# EAGLE design untitled (EAGLE 9.6.1)
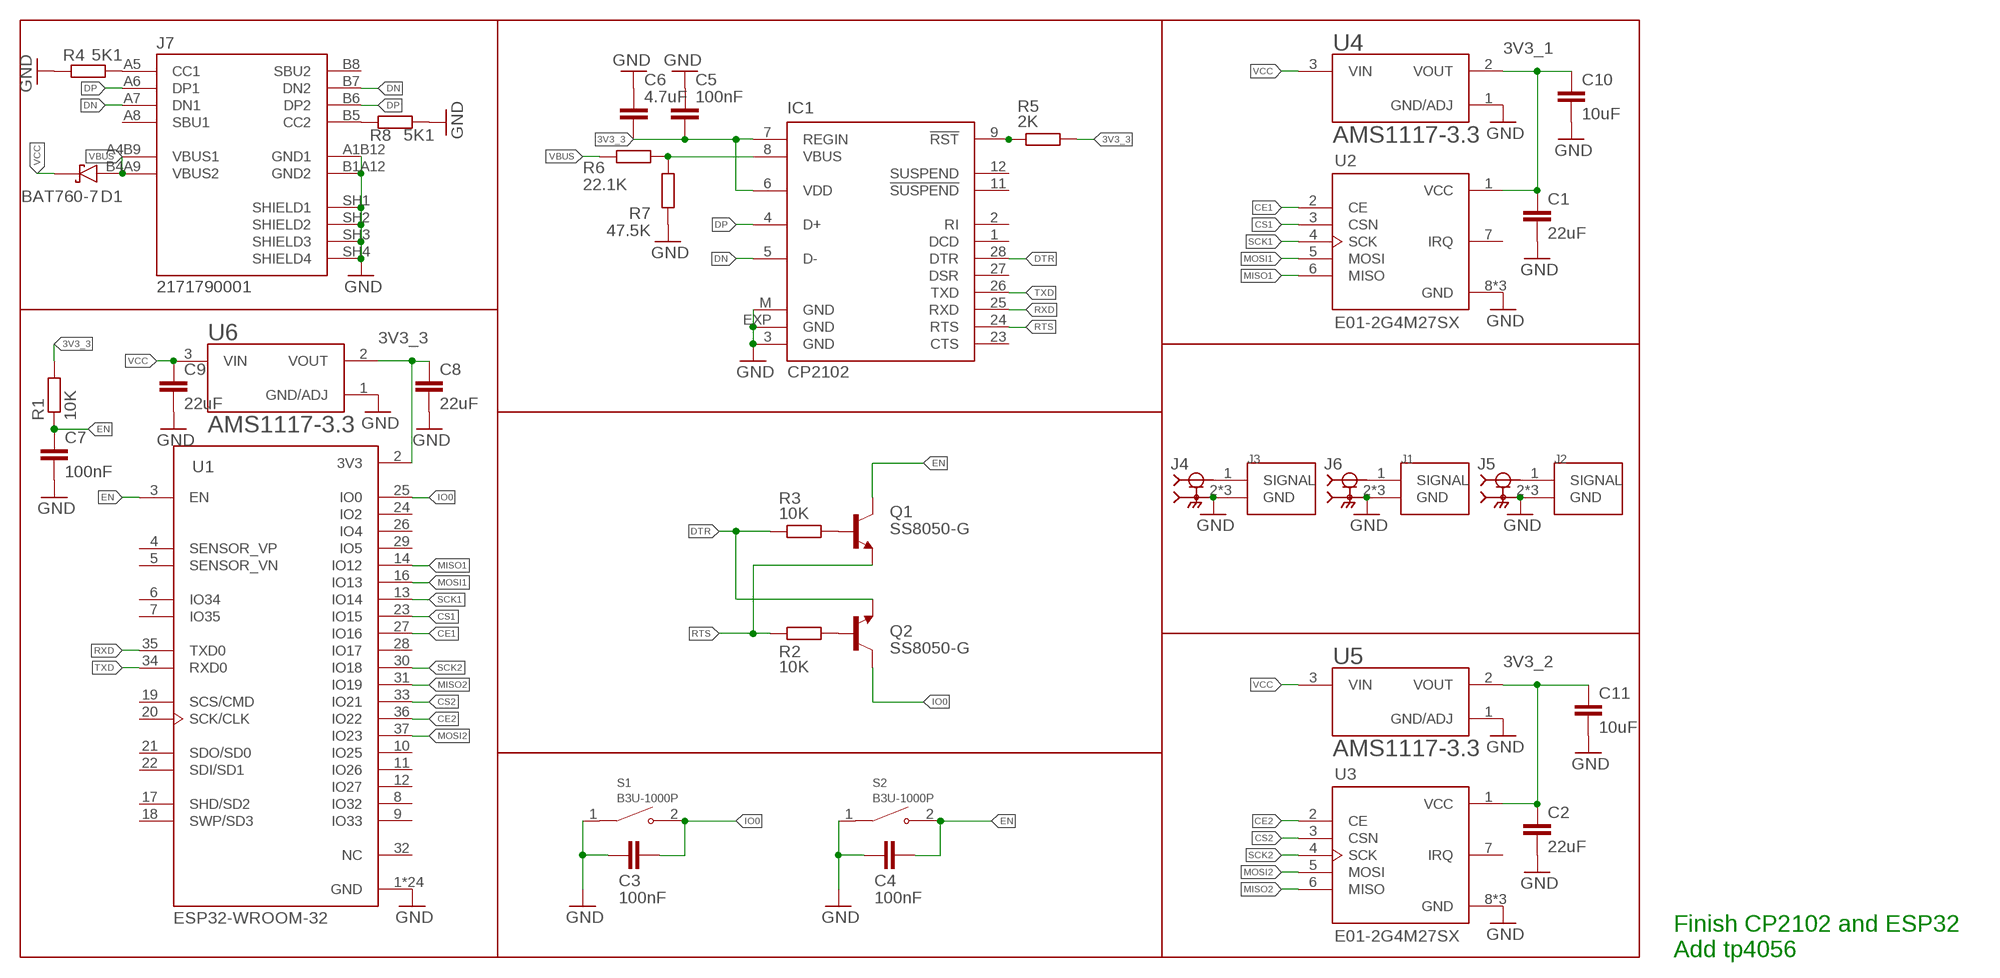
[diagram p0: schematic, sheet 1]

## Parts
C1  22uF  C-EUC0603  [C0603]
C2  22uF  C-EUC0603  [C0603]
C3  100nF  C-EUC0603  [C0603]
C4  100nF  C-EUC0603  [C0603]
C5  100nF  C-EUC0603  [C0603]
C6  4.7uF  C-EUC0603  [C0603]
C7  100nF  C-EUC0603  [C0603]
C8  22uF  C-EUC0603  [C0603]
C9  22uF  C-EUC0603  [C0603]
C10  10uF  C-EUC0603  [C0603]
C11  10uF  C-EUC0603  [C0603]
D1  BAT760-7  [SOD2513X120N]
IC1  CP2102  [MLP28]
J1  RSP-122811-02  [SAMTEC_RSP-122811-02]
J2  RSP-122811-02  [SAMTEC_RSP-122811-02]
J3  RSP-122811-02  [SAMTEC_RSP-122811-02]
J4  SMA-J-P-X-RA-TH1  [SAMTEC_SMA-J-P-X-RA-TH1]
J5  SMA-J-P-X-RA-TH1  [SAMTEC_SMA-J-P-X-RA-TH1]
J6  SMA-J-P-X-RA-TH1  [SAMTEC_SMA-J-P-X-RA-TH1]
J7  2171790001  [MOLEX_2171790001]
Q1  SS8050-G  [TRANS_SS8050-G]
Q2  SS8050-G  [TRANS_SS8050-G]
R1  10K  R-EU_R0603  [R0603]
R2  10K  R-EU_R0603  [R0603]
R3  10K  R-EU_R0603  [R0603]
R4  5K1  R-EU_R0603  [R0603]
R5  2K  R-EU_R0603  [R0603]
R6  22.1K  R-EU_R0603  [R0603]
R7  47.5K  R-EU_R0603  [R0603]
R8  5K1  R-EU_R0603  [R0603]
S1  B3U-1000P  [SW_B3U-1000P]
S2  B3U-1000P  [SW_B3U-1000P]
U1  ESP32-WROOM-32  [MODULE_ESP32-WROOM-32]
U2  E01-2G4M27SX  [XCVR_E01-2G4M27SX]
U3  E01-2G4M27SX  [XCVR_E01-2G4M27SX]
U4  AMS1117-3.3  [SOT229P700X180-4N]
U5  AMS1117-3.3  [SOT229P700X180-4N]
U6  AMS1117-3.3  [SOT229P700X180-4N]

## Nets
3V3_1: C1.1 C10.1 U2.1(VCC) U4.2(VOUT)
3V3_2: C2.1 C11.1 U3.1(VCC) U5.2(VOUT)
3V3_3: C5.2 C6.2 C8.1 IC1.6(VDD) IC1.7(REGIN) R1.2 R5.2 U1.2(3V3) U6.2(VOUT)
CE1: U1.27(IO16) U2.2(CE)
CE2: U1.36(IO22) U3.2(CE)
CS1: U1.23(IO15) U2.3(CSN)
CS2: U1.33(IO21) U3.3(CSN)
DN: IC1.5(D-) J7.A7(DN1) J7.B7(DN2)
DP: IC1.4(D+) J7.A6(DP1) J7.B6(DP2)
DTR: IC1.28(DTR) Q2.2(E) R3.1
EN: C4.2 C7.1 Q1.3(C) R1.1 S2.2 U1.3(EN)
GND: C1.2 C2.2 C3.1 C4.1 C5.1 C6.1 C7.2 C8.2 C9.2 C10.2 C11.2 IC1.3(GND) IC1.EXP(GND) IC1.M(GND) J1.2(GND) J1.3(GND) J1.4(GND) J2.2(GND) J2.3(GND) J2.4(GND) J3.2(GND) J3.3(GND) J3.4(GND) J4.2 J4.3 J4.4 J4.5 J5.2 J5.3 J5.4 J5.5 J6.2 J6.3 J6.4 J6.5 J7.A1B12(GND1) J7.B1A12(GND2) J7.SH1(SHIELD1) J7.SH2(SHIELD2) J7.SH3(SHIELD3) J7.SH4(SHIELD4) R4.1 R7.1 R8.2 S1.1 S2.1 U1.1(GND) U1.15(GND) U1.38(GND) U1.39_1(GND) U1.39_2(GND) U1.39_3(GND) U1.39_4(GND) U1.39_5(GND) U1.39_6(GND) U1.39_7(GND) U1.39_8(GND) U1.39_9(GND) U1.39_10(GND) U1.39_11(GND) U1.39_12(GND) U1.39_13(GND) U1.39_14(GND) U1.39_15(GND) U1.39_16(GND) U1.39_17(GND) U1.39_18(GND) U1.39_19(GND) U1.39_20(GND) U1.39_21(GND) U2.8(GND) U2.9(GND) U2.10(GND) U3.8(GND) U3.9(GND) U3.10(GND) U4.1(GND/ADJ) U5.1(GND/ADJ) U6.1(GND/ADJ)
IO0: C3.2 Q2.3(C) S1.2 U1.25(IO0)
MISO1: U1.14(IO12) U2.6(MISO)
MISO2: U1.31(IO19) U3.6(MISO)
MOSI1: U1.16(IO13) U2.5(MOSI)
MOSI2: U1.37(IO23) U3.5(MOSI)
N$1: J3.1(SIGNAL) J4.1
N$2: J7.A5(CC1) R4.2
N$3: J2.1(SIGNAL) J5.1
N$4: J7.B5(CC2) R8.1
N$5: J1.1(SIGNAL) J6.1
N$6: Q1.1(B) R3.2
N$8: Q2.1(B) R2.2
N$9: IC1.9(!RST) R5.1
N$18: IC1.8(VBUS) R6.2 R7.2
RTS: IC1.24(RTS) Q1.2(E) R2.1
RXD: IC1.25(RXD) U1.35(TXD0)
SCK1: U1.13(IO14) U2.4(SCK)
SCK2: U1.30(IO18) U3.4(SCK)
TXD: IC1.26(TXD) U1.34(RXD0)
VBUS: D1.A J7.A4B9(VBUS1) J7.B4A9(VBUS2) R6.1
VCC: C9.1 D1.C(K) U4.3(VIN) U5.3(VIN) U6.3(VIN)
Unconnected: IC1.1(DCD) IC1.2(RI) IC1.11(!SUSPEND) IC1.12(SUSPEND) IC1.23(CTS) IC1.27(DSR) J7.A8(SBU1) J7.B8(SBU2) U1.4(SENSOR_VP) U1.5(SENSOR_VN) U1.6(IO34) U1.7(IO35) U1.8(IO32) U1.9(IO33) U1.10(IO25) U1.11(IO26) U1.12(IO27) U1.17(SHD/SD2) U1.18(SWP/SD3) U1.19(SCS/CMD) U1.20(SCK/CLK) U1.21(SDO/SD0) U1.22(SDI/SD1) U1.24(IO2) U1.26(IO4) U1.28(IO17) U1.29(IO5) U1.32(NC) U2.7(IRQ) U3.7(IRQ)

## Notes on the sheet
- Finish CP2102 and ESP32
  Add tp4056

## Library data of the parts
C1-C11 = rcl:C-EU: CAPACITOR, European symbol; SPICEPREFIX: C
D1 = BAT760-7:BAT760-7: Diode Schottky 30V 1A Surface Mount SOD-323 Check availability <https://pricing.snapeda.com/parts/BAT760-7/Diodes%20Inc./view-part?ref=eda>; AVAILABILITY: In Stock; CHECK_PRICES: https://www.snapeda.com/parts/BAT760-7/Diodes+Inc./view-part/?ref=eda; DESCRIPTION: Diode Schottky 30V 1A 2Pin SOD323 | Diodes Inc BAT760-7; MF: Diodes Inc.; MP: BAT760-7; PACKAGE: SOD-323 Diodes Inc.; PRICE: None; SNAPEDA_LINK: https://www.snapeda.com/parts/BAT760-7/Diodes+Inc./view-part/?ref=snap
IC1 = silabs:CP210*: Single-Chip USB to UART Bridge Source: www.silabs.com .. CP2101.pdf / cp2102.pdf; MF: FARNELL; MPN: CP2102-GM; OC_FARNELL: 9282130; OC_NEWARK: 30K5635
J1-J3 = IPEX_conn_male:RSP-122811-02: Check availability <https://pricing.snapeda.com/parts/RSP-122811-02/Samtec%20Inc./view-part?ref=eda>; AVAILABILITY: In Stock; CHECK_PRICES: https://www.snapeda.com/parts/RSP-122811-02/Samtec+Inc./view-part/?ref=eda; DESCRIPTION: I-PEX MHFIII Connector Receptacle, Male Pin 50 Ohms Surface Mount Solder; MF: Samtec Inc.; MP: RSP-122811-02; PACKAGE: None; PRICE: None; SNAPEDA_LINK: https://www.snapeda.com/parts/RSP-122811-02/Samtec+Inc./view-part/?ref=snap
J4-J6 = SMA-J-P-X-RA-TH1:SMA-J-P-X-RA-TH1: Check availability <https://pricing.snapeda.com/parts/SMA-J-P-H-RA-TH1/Samtec/view-part?ref=eda>; AVAILABILITY: In Stock; CHECK_PRICES: https://www.snapeda.com/parts/SMA-J-P-H-RA-TH1/Samtec+Inc./view-part/?ref=eda; DESCRIPTION: SMA Connector Jack, Female Socket 50 Ohms Through Hole, Right Angle Solder; MF: Samtec; MP: SMA-J-P-H-RA-TH1; PACKAGE: None; PRICE: None; SNAPEDA_LINK: https://www.snapeda.com/parts/SMA-J-P-H-RA-TH1/Samtec+Inc./view-part/?ref=snap
J7 = type_C:2171790001: Check availability <https://pricing.snapeda.com/parts/217179-0001/Molex/view-part?ref=eda>; AVAILABILITY: In Stock; CHECK_PRICES: https://www.snapeda.com/parts/217179-0001/Molex/view-part/?ref=eda; DESCRIPTION: USB Type C - Connector, Top-mount SMT, 16pos | Molex Incorporated 217179-0001; MF: Molex; MP: 217179-0001; PACKAGE: None; PRICE: None; SNAPEDA_LINK: https://www.snapeda.com/parts/217179-0001/Molex/view-part/?ref=snap
Q1 Q2 = SS8050-G:SS8050-G: Bipolar (BJT) Transistor NPN 25 V 1.5 A 100MHz 300 mW Surface Mount SOT-23-3 Check availability <https://pricing.snapeda.com/parts/SS8050-G/Comchip%20Technology/view-part?ref=eda>; AVAILABILITY: In Stock; CHECK_PRICES: https://www.snapeda.com/parts/SS8050-G/Comchip+Technology/view-part/?ref=eda; DESCRIPTION: Bipolar (BJT) Transistor NPN 25 V 1.5 A 100MHz 300 mW Surface Mount SOT-23-3; MF: Comchip Technology; MP: SS8050-G; PACKAGE: TO-236 Comchip; PRICE: None; SNAPEDA_LINK: https://www.snapeda.com/parts/SS8050-G/Comchip+Technology/view-part/?ref=snap
R1-R8 = rcl:R-EU_: RESISTOR, European symbol; SPICEPREFIX: R
S1 S2 = SMD_button:B3U-1000P: Switch Tactile N.O. SPST Round Button Gull Wing 0.05A 12VDC 1.5N SMD Embossed T/R Check availability <https://pricing.snapeda.com/parts/B3U-1000P/Omron/view-part?ref=eda>; AVAILABILITY: In Stock; CHECK_PRICES: https://www.snapeda.com/parts/B3U-1000P/Omron+Electronics+Inc-EMC+Div/view-part/?ref=eda; DESCRIPTION: SWITCH;TACTILE,TOP ACTUATED,TACTILE & JOG SWITCHES W/O BOSS W/O GROUND | Omron Electronic Components B3U-1000P; MF: Omron; MP: B3U-1000P; PACKAGE: Custom Package Omron; PRICE: None; SNAPEDA_LINK: https://www.snapeda.com/parts/B3U-1000P/Omron+Electronics+Inc-EMC+Div/view-part/?ref=snap
U1 = ESP32-WROOM-32:ESP32-WROOM-32: Check availability <https://pricing.snapeda.com/parts/ESP32-WROOM-32/Espressif%20Systems/view-part?ref=eda>; AVAILABILITY: In Stock; CHECK_PRICES: https://www.snapeda.com/parts/ESP32-WROOM-32/Espressif+Systems/view-part/?ref=eda; DESCRIPTION: Bluetooth, WiFi 802.11b/g/n, Bluetooth v4.2 +EDR, Class 1, 2 and 3 Transceiver Module 2.4GHz ~ 2.5GHz Antenna Not Included, U.FL Surface Mount; MF: Espressif Systems; MP: ESP32-WROOM-32; PACKAGE: None; PRICE: None; SNAPEDA_LINK: https://www.snapeda.com/parts/ESP32-WROOM-32/Espressif+Systems/view-part/?ref=snap
U2 U3 = E01-2G4M27SX:E01-2G4M27SX: Check availability <https://pricing.snapeda.com/parts/E01-2G4M27SX/EBYTE/view-part?ref=eda>; AVAILABILITY: Not in stock; CHECK_PRICES: https://www.snapeda.com/parts/E01-2G4M27SX/EBYTE/view-part/?ref=eda; DESCRIPTION: nRF42L01+2.4GHz 500mW SPI SMD wireless module; MF: EBYTE; MP: E01-2G4M27SX; PACKAGE: Package; PRICE: None; SNAPEDA_LINK: https://www.snapeda.com/parts/E01-2G4M27SX/EBYTE/view-part/?ref=snap
U4-U6 = AMS1117-3.3:AMS1117-3.3: Check availability <https://pricing.snapeda.com/parts/AMS1117-3.3/Advanced%20Monolithic%20Systems/view-part?ref=eda>; AVAILABILITY: Not in stock; CHECK_PRICES: https://www.snapeda.com/parts/AMS1117-3.3/Advanced+Monolithic+Systems/view-part/?ref=eda; DESCRIPTION: Sot223/Pkg 1-Amp 3.3-Volt Low Drop Out Voltage Regulatator; MF: Advanced Monolithic Systems; MP: AMS1117-3.3; PACKAGE: SOT-223 Seeed Technology; PRICE: None; SNAPEDA_LINK: https://www.snapeda.com/parts/AMS1117-3.3/Advanced+Monolithic+Systems/view-part/?ref=snap

## Board
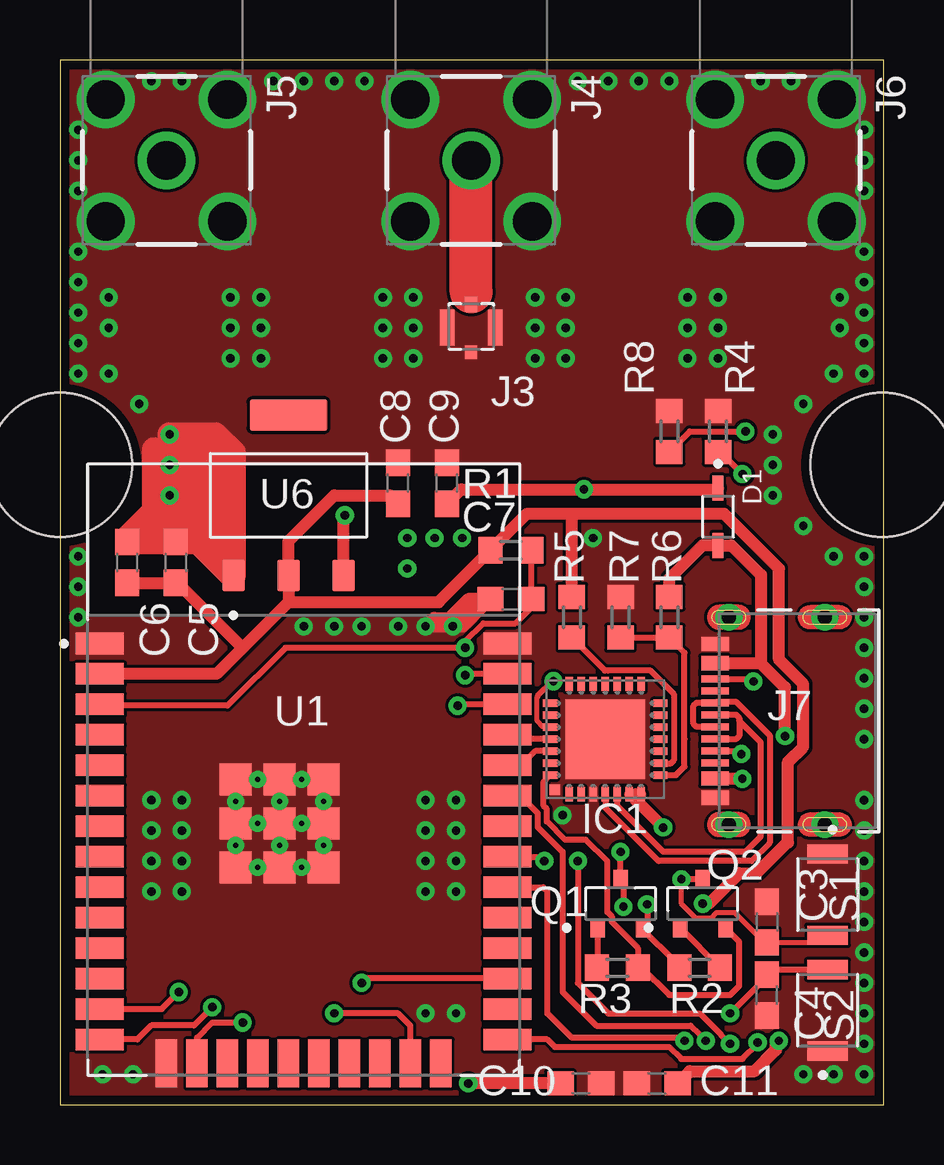
[diagram p1: board, top side]
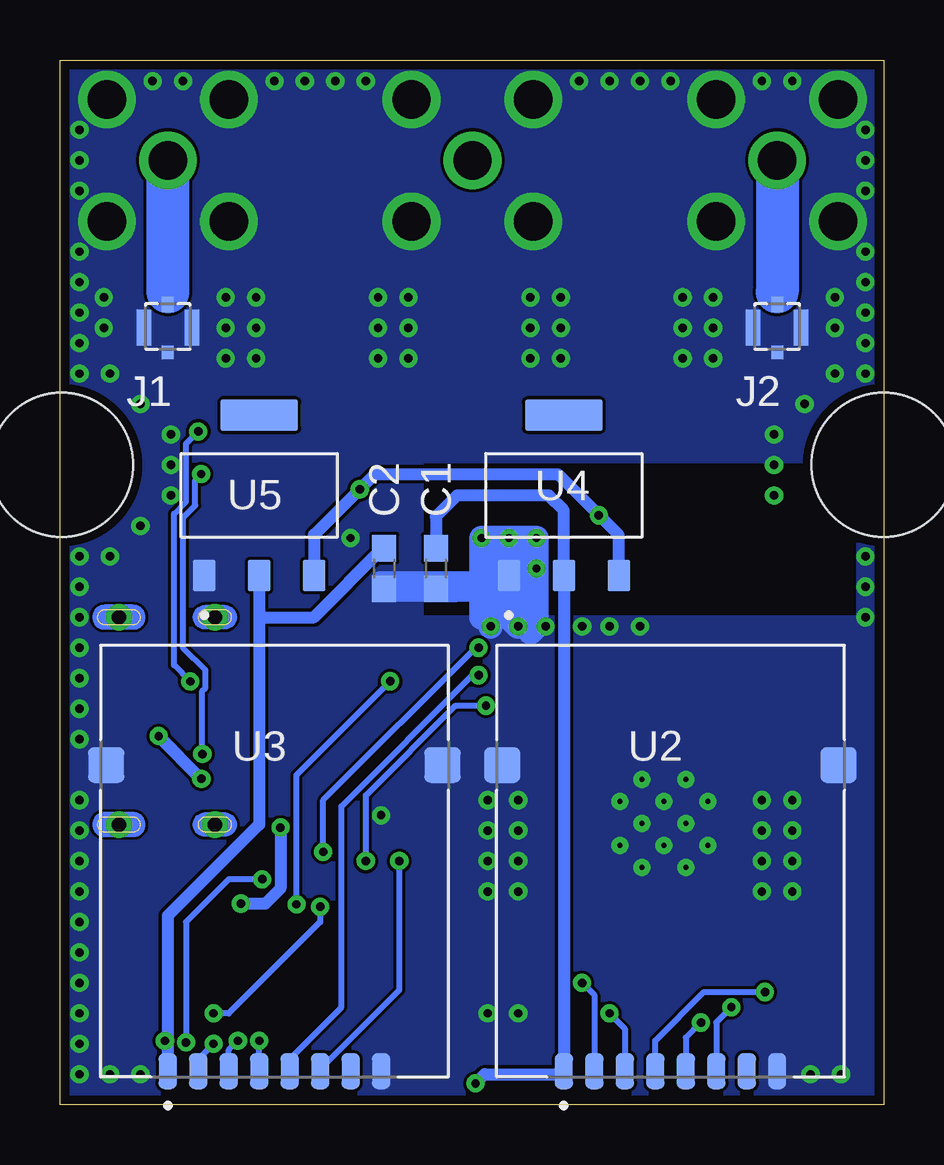
[diagram p2: board, bottom side, seen from below]

Size 34.34 x 43.55 mm. Coordinates in mm from the lower left corner, seen from the top.
Outline: 0,0 34.34,0 34.34,43.55 0,43.55 0,0
Copper layers (1*16): Top 0.035mm / dielectric 1.5mm / Bottom 0.035mm
Design rules "default *": minimum track width 5mil, minimum drill 0.3mm, track to track 5mil, track to pad 5mil, pad to pad 5mil, via to via 5mil, smd to smd 5mil, copper to edge 15mil, drill to drill 5mil, minimum pad ring 10mil, minimum via ring 8mil, stop-mask expansion 4mil, vias tented up to drill 0mil, thermal gap 10mil
Holes 6 mm at 0,26.67 34.29,26.67

### Footprints (pad centres in the part's own frame; a part is rotated, then mirrored left to right if it is on the bottom)
C0603 = smd 1.1 x 1: 1 -0.85,0; 2 0.85,0
SOD2513X120N = smd 1.04 x 0.46: A 1.19,0; C -1.19,0
MLP28 = smd 0.6 x 0.3: 1 -2.3,1.5; 2 -2.3,1; 3 -2.3,0.5; 4 -2.3,0; 5 -2.3,-0.5; 6 -2.3,-1; 7 -2.3,-1.5; 15 2.3,-1.5; 16 2.3,-1; 17 2.3,-0.5; 18 2.3,0; 19 2.3,0.5; 20 2.3,1; 21 2.3,1.5 | smd 0.3 x 0.6: 8 -1.5,-2.3; 9 -1,-2.3; 10 -0.5,-2.3; 11 0,-2.3; 12 0.5,-2.3; 13 1,-2.3; 14 1.5,-2.3; 22 1.5,2.3; 23 1,2.3; 24 0.5,2.3; 25 0,2.3; 26 -0.5,2.3; 27 -1,2.3; 28 -1.5,2.3 | smd 3.3 x 3.3: EXP 0,0 | smd 0.435 x 0.435: M -2.103,2.103
SAMTEC_RSP-122811-02 = smd 0.5 x 0.65: 1 0,-0.975 | smd 0.6 x 1.5: 2 -1,0; 4 1,0 | smd 0.5 x 0.55: 3 0,1.025
SAMTEC_SMA-J-P-X-RA-TH1 = drill 1.6: 1 0,0; 2 2.54,-2.54; 3 2.54,2.54; 4 -2.54,2.54; 5 -2.54,-2.54
MOLEX_2171790001 = smd 0.59 x 1.15: A1B12 -3.2,3.425; A4B9 -2.4,3.425; B1A12 3.2,3.425; B4A9 2.4,3.425 | smd 0.298 x 1.15: A5 -1.25,3.425; A6 -0.25,3.425; A7 0.25,3.425; A8 1.25,3.425; B5 1.75,3.425; B6 0.75,3.425; B7 -0.75,3.425; B8 -1.75,3.425 | drill 0.6 pad 1: SH1 -4.32,-1.15; SH2 4.32,-1.15; SH3 -4.32,2.85; SH4 4.32,2.85
TRANS_SS8050-G = smd 0.8 x 0.6: 1 -1.01,0.95; 2 -1.01,-0.95; 3 1.01,0
R0603 = smd 1 x 1.1: 1 -0.85,0; 2 0.85,0
SW_B3U-1000P = smd 0.8 x 1.7: 1 -1.7,0; 2 1.7,0
MODULE_ESP32-WROOM-32 = smd 2 x 0.9: 1 -8.5,5.26; 2 -8.5,3.99; 3 -8.5,2.72; 4 -8.5,1.45; 5 -8.5,0.18; 6 -8.5,-1.09; 7 -8.5,-2.36; 8 -8.5,-3.63; 9 -8.5,-4.9; 10 -8.5,-6.17; 11 -8.5,-7.44; 12 -8.5,-8.71; 13 -8.5,-9.98; 14 -8.5,-11.25; 25 8.5,-11.25; 26 8.5,-9.98; 27 8.5,-8.71; 28 8.5,-7.44; 29 8.5,-6.17; 30 8.5,-4.9; 31 8.5,-3.63; 32 8.5,-2.36; 33 8.5,-1.09; 34 8.5,0.18; 35 8.5,1.45; 36 8.5,2.72; 37 8.5,3.99; 38 8.5,5.26 | smd 0.9 x 2: 15 -5.715,-12.25; 16 -4.445,-12.25; 17 -3.175,-12.25; 18 -1.905,-12.25; 19 -0.635,-12.25; 20 0.635,-12.25; 21 1.905,-12.25; 22 3.175,-12.25; 23 4.445,-12.25; 24 5.715,-12.25 | smd 1.33 x 1.33: 39_1 -2.835,-0.405; 39_2 -1,-0.405; 39_3 0.835,-0.405; 39_4 -2.835,-2.24; 39_5 -1,-2.24; 39_6 0.835,-2.24; 39_7 -2.835,-4.075; 39_8 -1,-4.075; 39_9 0.835,-4.075 | drill 0.2 pad 0.3: 39_10 -1.917,-0.405; 39_11 -0.083,-0.405; 39_12 -2.835,-1.323; 39_13 -1,-1.323; 39_14 0.835,-1.323; 39_15 -1.917,-2.24; 39_16 -0.083,-2.24; 39_17 -2.835,-3.158; 39_18 -1,-3.158; 39_19 0.835,-3.158; 39_20 -1.917,-4.075; 39_21 -0.083,-4.075
XCVR_E01-2G4M27SX = smd 0.77 x 1.51: 1 4.445,8.76; 2 3.175,8.76; 3 1.905,8.76; 4 0.635,8.76; 5 -0.635,8.76; 6 -1.905,8.76; 7 -3.175,8.76; 8 -4.445,8.76 | smd 1.51 x 1.47: 9 -7.01,-4; 10 7.01,-4
SOT229P700X180-4N = smd 1.31 x 0.93: 1 -3.345,2.29; 2 -3.345,0; 3 -3.345,-2.29 | smd 1.31 x 3.24: 4 3.345,0

### Placement (x,y rotation side)
C1  18.67,22.35 270 bottom
C2  20.83,22.35 270 bottom
C3  29.46,7.62 270 top
C4  29.46,4.57 90 top
C5  4.83,22.61 270 top
C6  2.79,22.61 270 top
C7  18.8,21.08 180 top
C8  14.1,25.91 90 top
C9  16.13,25.91 90 top
C10  21.72,0.89 0 top
C11  24.89,0.89 180 top
D1  27.43,24.51 270 top
IC1  22.73,15.24 90 top
J1  29.84,32.38 180 bottom
J2  4.45,32.38 180 bottom
J3  17.14,32.38 180 top
J4  17.14,39.37 270 top
J5  4.45,39.37 270 top
J6  29.84,39.37 270 top
J7  30.73,16 90 top
Q1  23.37,8.38 90 top
Q2  26.8,8.38 90 top
R1  18.8,23.11 180 top
R2  26.67,5.71 0 top
R3  23.24,5.71 180 top
R4  27.43,28.07 270 top
R5  21.34,20.32 90 top
R6  25.4,20.32 270 top
R7  23.37,20.32 270 top
R8  25.4,28.07 90 top
S1  32,8.76 270 top
S2  32,3.94 90 top
U1  10.16,13.97 0 top
U2  8.89,10.16 180 bottom
U3  25.4,10.16 180 bottom
U4  13.34,25.4 90 bottom
U5  26.04,25.4 90 bottom
U6  9.53,25.4 90 top

### Tracks (layer width: path | path; a pad name or v marks a point on that pad's centre or on a via)
3V3_1  (via drill 0.35)
  Top 0.508: C10.1 v17.02,0.89
  Bottom 0.508: C1.1 18.67,24.51 17.78,25.4 13.97,25.4 13.34,24.77 U4.2 U2.1 13.46,1.27 16.63,1.27 v17.02,0.89
3V3_2  (via drill 0.35)
  Top 0.508: C11.1 26.25,1.4 28.96,1.4 29.84,2.28 29.84,2.54 v29.97,2.67
  Bottom 0.508: U5.2 26.04,20.32 | 26.04,20.32 26.04,11.68 29.84,7.87 U3.1 29.84,2.54 v29.97,2.67 | 26.04,20.32 23.75,20.32 20.87,23.2 C2.1
3V3_3  (via drill 0.35)
  Top 0.406: IC1.6 24,12.94 IC1.7
  Top 0.508: U1.2 6.53,17.96 7.62,19.05 | 9.53,20.95 U6.2 9.53,23.5 11.43,25.4 13.76,25.4 C8.1 | 7.62,19.05 9.53,20.95 | 24,12.94 24,12.7 v25.15,11.56 | v26.8,8.38 27.05,8.38 28.32,9.65 29.04,9.65 30.31,10.92 30.35,10.92 30.35,14.29 30.98,14.93 30.98,17.54 29.97,18.55 29.97,22.35 27.69,24.64 21.34,24.64 | C6.2 C5.2 4.91,21.76 7.62,19.05 | 21.34,24.64 19.47,24.64 R1.2 15.79,20.95 9.53,20.95 | R5.2 21.34,24.64
  Bottom 0.508: v25.15,11.56 25.15,9.01 25.78,8.38 v26.8,8.38
CE1  (via drill 0.35)
  Top 0.254: U1.27 12.76,5.26 v12.58,5.08
  Bottom 0.254: v12.58,5.08 v12.57,5.08 12.06,4.58 U2.2
CE2  (via drill 0.35)
  Top 0.254: v27.94,2.54 27.56,2.92 27.56,2.93 26.68,3.81 22.86,3.81 21.59,5.08 v21.59,10.16 | U1.36 16.63,16.69 v16.58,16.64
  Bottom 0.254: U3.2 28.57,1.91 v27.94,2.54 | v21.59,10.16 21.59,12.9 17.85,16.64 v16.58,16.64
CS1  (via drill 0.35)
  Top 0.254: U1.23 14.61,3.3 14.09,3.81 v11.43,3.81
  Bottom 0.254: v11.43,3.81 10.79,3.17 U2.3
CS2  (via drill 0.35)
  Top 0.254: v26.92,2.67 26.67,2.92 26.67,2.93 26.3,3.3 22.36,3.3 20.95,4.7 20.95,10.54 19.91,11.58 19.91,12.16 19.2,12.88 U1.33
  Bottom 0.254: U3.3 27.3,2.29 v26.92,2.67
DN
  Top 0.254: J7.B7 28.21,15.25 28.32,15.37 28.32,16.01 | 28.32,16.01 28.32,16.13 28.19,16.26 J7.A7 | 28.32,16.01 29.21,15.12 29.21,11.17 28.57,10.54 25.15,10.54 23.23,12.45 IC1.5
DP
  Top 0.254: J7.A6 26.54,15.75 26.42,15.88 26.42,16.64 26.54,16.76 27.3,16.76 J7.B6 27.34,16.78 28.21,16.78 29.59,15.4 29.59,10.92 28.83,10.16 24.95,10.16 22.73,12.38 IC1.4
DTR
  Top 0.254: Q2.2 28.32,6.8 28.32,4.95 27.94,4.57 25.4,4.57 24.26,5.71 R3.1 24.09,6.54 23,7.63 23,7.85 22.81,8.04 22.81,10.16 21.93,11.05 21.06,11.05 20.3,11.81 20.3,12.32 20.16,12.46 20.16,13.47 IC1.28
EN  (via drill 0.35)
  Top 0.254: v23.37,10.54 Q1.3 23.49,9.27 v23.49,8.25 | U1.3 1.71,16.64 6.99,16.64 9.4,19.05 v16.89,19.05 16.89,19.3 17.65,20.07 18.99,20.07 19.65,20.73 C7.1 R1.1 | v27.94,3.81 29.46,5.33 C4.2 29.68,5.64 S2.2
  Bottom 0.254: v23.37,10.54 23.37,12.7 17.02,19.05 v16.89,19.05 | v23.49,8.25 23.49,7.62 27.3,3.81 v27.94,3.81
GND  (via drill 0.35)
  Top 0.508: C7.2 17.69,21.08 16.55,19.94 v16.38,19.94 | C7.2 17.02,21.08 16.38,20.45 v16.38,19.94 | v16.38,19.94 v15.24,19.94 15.59,20.29 16.89,20.29 | C7.2 16.8,19.94 v16.38,19.94
  Top 1.016: v4.57,25.4 4.57,24.13 | 4.57,24.13 4.57,23.46 C5.1 | C5.1 3.81,23.46 | 3.81,23.46 C6.1 | C5.1 5.75,23.46 7.16,22.05 U6.1 | U6.1 7.24,23.46 6.35,23.46 5.68,24.13 4.57,24.13 | v4.57,26.67 4.57,27.23 | 4.57,27.23 v4.57,27.94 | v4.57,25.4 7.24,22.74 U6.1 | v4.57,26.67 7.24,24.01 U6.1 | v4.57,27.94 5.28,27.23 | U6.1 7.24,25.28 | 7.24,25.28 v4.57,27.94 | 7.24,25.28 7.24,25.79 5.08,27.94 | 7.24,25.28 7.24,26.67 | 7.24,26.67 7.24,27.18 6.48,27.94 5.97,27.94 | C6.1 3.94,24.6 3.94,25.53 | 4.57,25.23 v4.57,25.4 | v4.57,25.4 4.57,24.22 3.81,23.46 | C6.1 2.79,23.62 v4.57,25.4 | v4.57,25.4 3.94,26.04 | 3.94,26.04 3.94,27.3 4.01,27.23 4.57,27.23 | v4.57,26.67 4.57,26.16 3.94,25.53 | 3.94,25.53 3.94,26.04 | 7.24,26.67 5.97,27.94 | 5.97,27.94 v4.57,27.94
  Bottom 0.508: C1.2 16.85,21.5 16.76,21.59 | 16.51,22.35 16.89,21.97 18.92,21.97 | 18.92,21.97 18.16,21.21 17.78,21.21 | 16.76,21.21 17.78,21.21 | 18.92,21.97 21.08,21.97 21.08,21.76 C2.2 | C1.2 C2.2 | C1.2 18.96,21.21 20.54,21.21 20.62,21.29 | C2.2 20.62,21.29 | 17.78,21.21 17.86,21.29 20.62,21.29 | 17.78,21.21 17.02,21.97 16.38,21.97 | v16.38,19.94 16.61,20.17 16.76,20.17
  Bottom 1.016: 15.62,22.35 16.51,22.35 16.76,22.35 | v15.62,23.62 15.62,22.99 | U4.1 15.62,22.35 | 15.62,22.35 15.62,22.99 | 15.62,22.99 16.13,22.99 | v15.62,23.62 v16.76,23.62 | v16.76,23.62 16.76,22.35 | v16.38,19.94 16.38,21.97 16.76,22.35 | v15.24,19.94 15.43,20.13 | 15.43,20.13 15.62,20.32 U4.1 | 16.76,22.35 16.76,21.59 16.76,21.21 16.76,20.32 | v14.48,22.35 v14.48,23.62 v16.76,23.62 | v14.48,22.35 15.62,22.35 | v15.62,23.62 14.48,22.48 v14.48,22.35 | v14.48,22.35 14.48,19.94 14.73,19.68 | U4.1 15.43,21.86 15.43,20.13
  other vias: 15.24,12.7 16.51,12.7 16.51,11.43 15.24,11.43 15.24,8.89 15.24,10.16 16.51,10.16 16.51,8.89 25.4,42.67 24.13,42.67 22.86,42.67 21.59,42.67 12.7,42.67 11.43,42.67 10.16,42.67 8.89,42.67 0.76,34.29 5.08,42.67 3.81,42.67 0.76,38.1 0.76,39.37 0.76,40.64 0.76,35.56 0.76,33.02 0.76,31.75 0.76,30.48 2.03,30.48 3.3,29.21 0.76,22.86 0.76,21.59 0.76,20.32 33.53,40.64 29.21,42.67 30.48,42.67 33.53,39.37 33.53,38.1 33.53,35.56 33.53,34.29 33.53,33.02 33.53,31.75 33.53,30.48 32.26,30.48 30.99,29.21 29.72,27.94 29.72,26.67 29.72,25.4 30.99,24.13 32.26,22.86 33.53,22.86 33.53,21.59 33.53,20.32 33.53,19.05 33.53,17.78 33.53,16.51 33.53,15.24 33.53,12.7 33.53,11.43 33.53,10.16 33.53,8.89 33.53,7.62 33.53,6.35 33.53,5.08 33.53,3.81 33.53,2.54 33.53,1.27 32.26,1.27 30.99,1.27 3.05,1.27 1.78,1.27 7.11,32.38 8.38,32.38 7.11,33.66 7.11,31.11 8.38,31.11 8.38,33.66 14.73,31.11 14.73,32.38 14.73,33.66 13.46,33.66 13.46,32.38 13.46,31.11 19.81,31.11 19.81,32.38 19.81,33.66 21.08,33.66 21.08,32.38 21.08,31.11 27.43,32.38 26.16,32.38 26.16,33.66 27.43,33.66 27.43,31.11 26.16,31.11 32.51,32.38 32.51,33.66 2.03,33.66 2.03,32.38 14.1,19.94 12.57,19.94 11.43,19.94 10.16,19.94 20.95,12.06 3.81,12.7 5.08,12.7 5.08,11.43 5.08,10.16 5.08,8.89 3.81,8.89 3.81,10.16 3.81,11.43 16.51,3.81 15.24,3.81 22.23,23.62
  pour Top (no thermals): 0,0 0,43.56 34.42,43.56 34.42,0
  pour Bottom (no thermals): 0,0 0,43.56 34.42,43.56 34.42,0
IO0  (via drill 0.35)
  Top 0.203: v25.91,9.4 25.91,8.38 26.52,7.78 27.13,7.78 27.35,8 28.14,8 29.37,6.77 C3.2 31.71,6.77 S1.2
  Top 0.254: Q2.3 v25.91,9.4 | v29.09,2.6 29.09,2.54 28.46,1.91 25.9,1.91 25.39,2.41 20.63,2.41 20.32,2.72 U1.25
  Bottom 0.254: v25.91,9.4 27.3,9.4 29.09,7.62 v29.09,2.6
MISO1  (via drill 0.35)
  Top 0.152: 2.54,2.72 U1.14
  Top 0.254: v6.35,4.06 5.59,3.3 3.81,3.3 3.23,2.72 2.54,2.72
  Bottom 0.254: v6.35,4.06 6.99,3.43 U2.6
MISO2  (via drill 0.35)
  Top 0.254: U1.31 20.01,10.34 v20.19,10.16
  Bottom 0.254: v20.19,10.16 20.19,4.79 23.5,1.48 U3.6
MOSI1  (via drill 0.35)
  Top 0.254: v7.62,3.43 6.35,3.43 5.71,2.79 U1.16
  Bottom 0.254: v7.62,3.43 8.26,2.79 U2.5
MOSI2  (via drill 0.35)
  Top 0.254: U1.37 16.94,17.96 v16.89,17.91
  Bottom 0.254: v16.89,17.91 17.14,17.91 22.61,12.45 22.61,4.06 24.77,1.91 U3.5
N$1
  Top 0.254: J3.1 17.14,33.88
  Top 0.508: J3.1 17.14,33.66
  Top 1.783: 17.14,33.88 J4.1
N$2  (via drill 0.35)
  Top 0.254: J7.A5 28.27,14.75 v28.41,14.62 | v28.45,26.29 27.53,27.22 R4.2
  Bottom 0.254: v28.41,14.62 28.41,17.25 28.28,17.38 28.28,18.12 29.21,19.05 29.21,24.48 28.7,24.98 28.7,26.04 v28.45,26.29
N$3
  Bottom 0.508: J2.1 4.45,33.88
  Bottom 1.783: J5.1 4.45,33.88
N$4  (via drill 0.35)
  Top 0.254: J7.B5 28.8,17.75 v28.91,17.64 | v28.57,28.07 26.25,28.07 R8.1
  Bottom 0.254: v28.91,17.64 29.59,18.32 29.59,24.63 29.09,25.14 29.09,27.56 v28.57,28.07
N$5
  Bottom 0.508: J1.1 29.84,33.88
  Bottom 1.783: J6.1 29.84,33.88
N$6
  Top 0.254: R3.2 22.42,5.74 Q1.1
N$8
  Top 0.254: Q2.1 25.86,7.37 R2.2
N$9
  Top 0.254: IC1.9 25.06,14.21 25.44,14.21 25.59,14.36 25.59,17.12 24.61,18.09 22.86,18.09 22.71,18.09 R5.1
N$18
  Top 0.254: R7.2 R6.2 26.04,18.84 26.04,15.24 26.04,14.1 25.68,13.74 IC1.8
RTS  (via drill 0.35)
  Top 0.203: IC1.24 20.16,15.73 19.89,16.01 19.89,17 19.91,17.03
  Top 0.254: R2.1 25.61,5.93 25.61,5.99 24.32,7.28 Q1.2 24.48,7.54 v24.48,8.35 | v20.57,17.65 20.54,17.65 19.91,17.03
  Bottom 0.254: v20.57,17.65 24.48,13.74 v24.48,8.35
RXD
  Top 0.254: U1.35 18.84,15.24 IC1.25
SCK1  (via drill 0.35)
  Top 0.254: U1.13 4.24,3.99 v4.95,4.7
  Bottom 0.254: U2.4 9.53,2.67 7.49,4.7 v4.95,4.7
SCK2  (via drill 0.35)
  Top 0.254: U1.30 20.14,9.07 20.32,8.89 20.32,3.81 21.34,2.79 25.91,2.79 v26.04,2.67
  Bottom 0.254: U3.4 v26.04,2.67
TXD
  Top 0.254: U1.34 19.23,14.15 19.82,14.74 IC1.26
VBUS  (via drill 0.35)
  Top 0.508: J7.A4B9 28.43,13.6 v28.45,13.59 | v30.23,15.37 30.23,17.4 29.22,18.4 | 29.22,18.4 J7.B4A9 | R6.1 25.4,21.93 26.79,23.32 D1.A 27.99,23.32 29.22,22.09 29.22,18.4
  Bottom 0.508: v28.45,13.59 v30.23,15.37
VCC  (via drill 0.35)
  Top 0.508: U6.3 11.81,24.52 v11.87,24.57 | C9.1 16.73,25.65 v21.84,25.65 27.39,25.65 D1.C
  Bottom 0.508: U4.3 11.04,23.75 v11.87,24.57 13.59,26.29 21.21,26.29 v21.84,25.65 23.75,23.75 U5.3